# EAGLE design WaterProbe_4 (EAGLE 9.1.3)
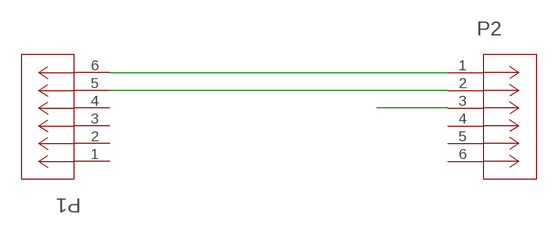
[diagram p0: schematic, sheet 1]

## Parts
P1  6PINJSTS6B-ZR(LF)(SN)  [S6B-ZR]
P2  6PINJSTS6B-ZR(LF)(SN)  [S6B-ZR]

## Nets
N$1: P1.6 P2.1
N$2: P1.5 P2.2
N$3: P2.3
Unconnected: P1.1 P1.2 P1.3 P1.4 P2.4 P2.5 P2.6

## Library data of the parts
P1 P2 = DROP 6pin JST:6PINJSTS6B-ZR(LF)(SN): 6 pin JST Connector Sourced from Digikey; MANUFACTURER_PART_NUMBER: S6BZRLFSN; VENDOR: JST

## Board
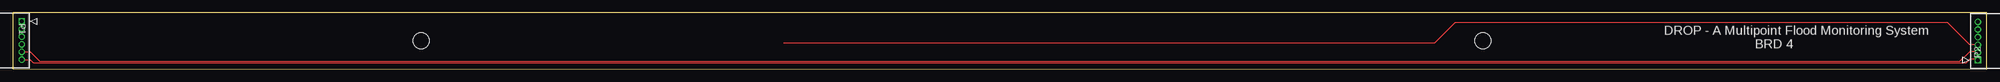
[diagram p1: board, top side]

Size 386.74 x 11.04 mm. Coordinates in mm from the lower left corner, seen from the top.
Outline: 0,0.04 386.74,0 386.74,11 0,11.04 0,0.04
Copper layers (1*16): Top 0.035mm / dielectric 1.5mm / Bottom 0.035mm
Design rules "default": minimum track width 6mil, minimum drill 0.35mm, track to track 6mil, track to pad 6mil, pad to pad 6mil, via to via 6mil, smd to smd 6mil, copper to edge 40mil, drill to drill 6mil, minimum pad ring 10mil, minimum via ring 8mil, stop-mask expansion 4mil, vias tented up to drill 0mil, thermal gap 10mil
Holes 3.2 mm at 80,5.54 288,5.54

### Footprints (pad centres in the part's own frame; a part is rotated, then mirrored left to right if it is on the bottom)
S6B-ZR = drill 0.762 pad 1.27 square: 1 -7.493,0 | drill 0.762 pad 1.27: 2 -5.994,0; 3 -4.496,0; 4 -2.997,0; 5 -1.499,0; 6 0,0

### Placement (x,y rotation side)
P1  1.76,1.87 270 top
P2  385.01,9.26 90 top

### Tracks (layer width: path | path; a pad name or v marks a point on that pad's centre or on a via)
N$1
  Top 0.152: P1.6 3.42,1.87 4.05,1.24 382.69,1.24 383.5,2.04 384.99,2.04 385.01,2.02
N$2
  Top 0.152: P1.5 3.42,3.37 5.25,1.54 381.5,1.54 383.5,3.54 384.74,3.54 P2.2
N$3
  Top 0.152: P2.3 383.4,4.76 379.12,9.04 282.5,9.04 278.75,5.29 278.5,5.04 151,5.04

### Text on the board
tNames: DROP - A Multipoint Flood Monitoring System / BRD 4